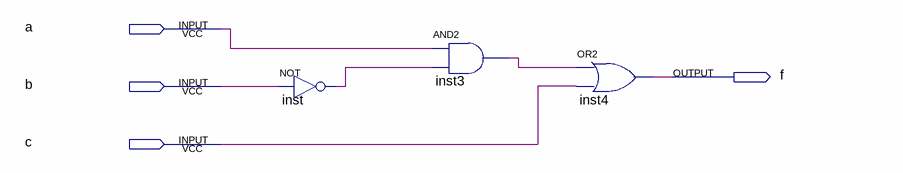
[diagram p0: schematic sheet]
// Quartus schematic X0104.bdf as structural Verilog: 3 symbols, 4 pins
module X0104 (
  input  a,
  input  b,
  input  c,
  output f
);

  wire inst3_out, inst_out;

  not inst (inst_out, b);
  and inst3 (inst3_out, a, inst_out);
  or inst4 (f, inst3_out, c);
endmodule
